# EAGLE design BPMLabLineRX3.2 (EAGLE 7.5.0)
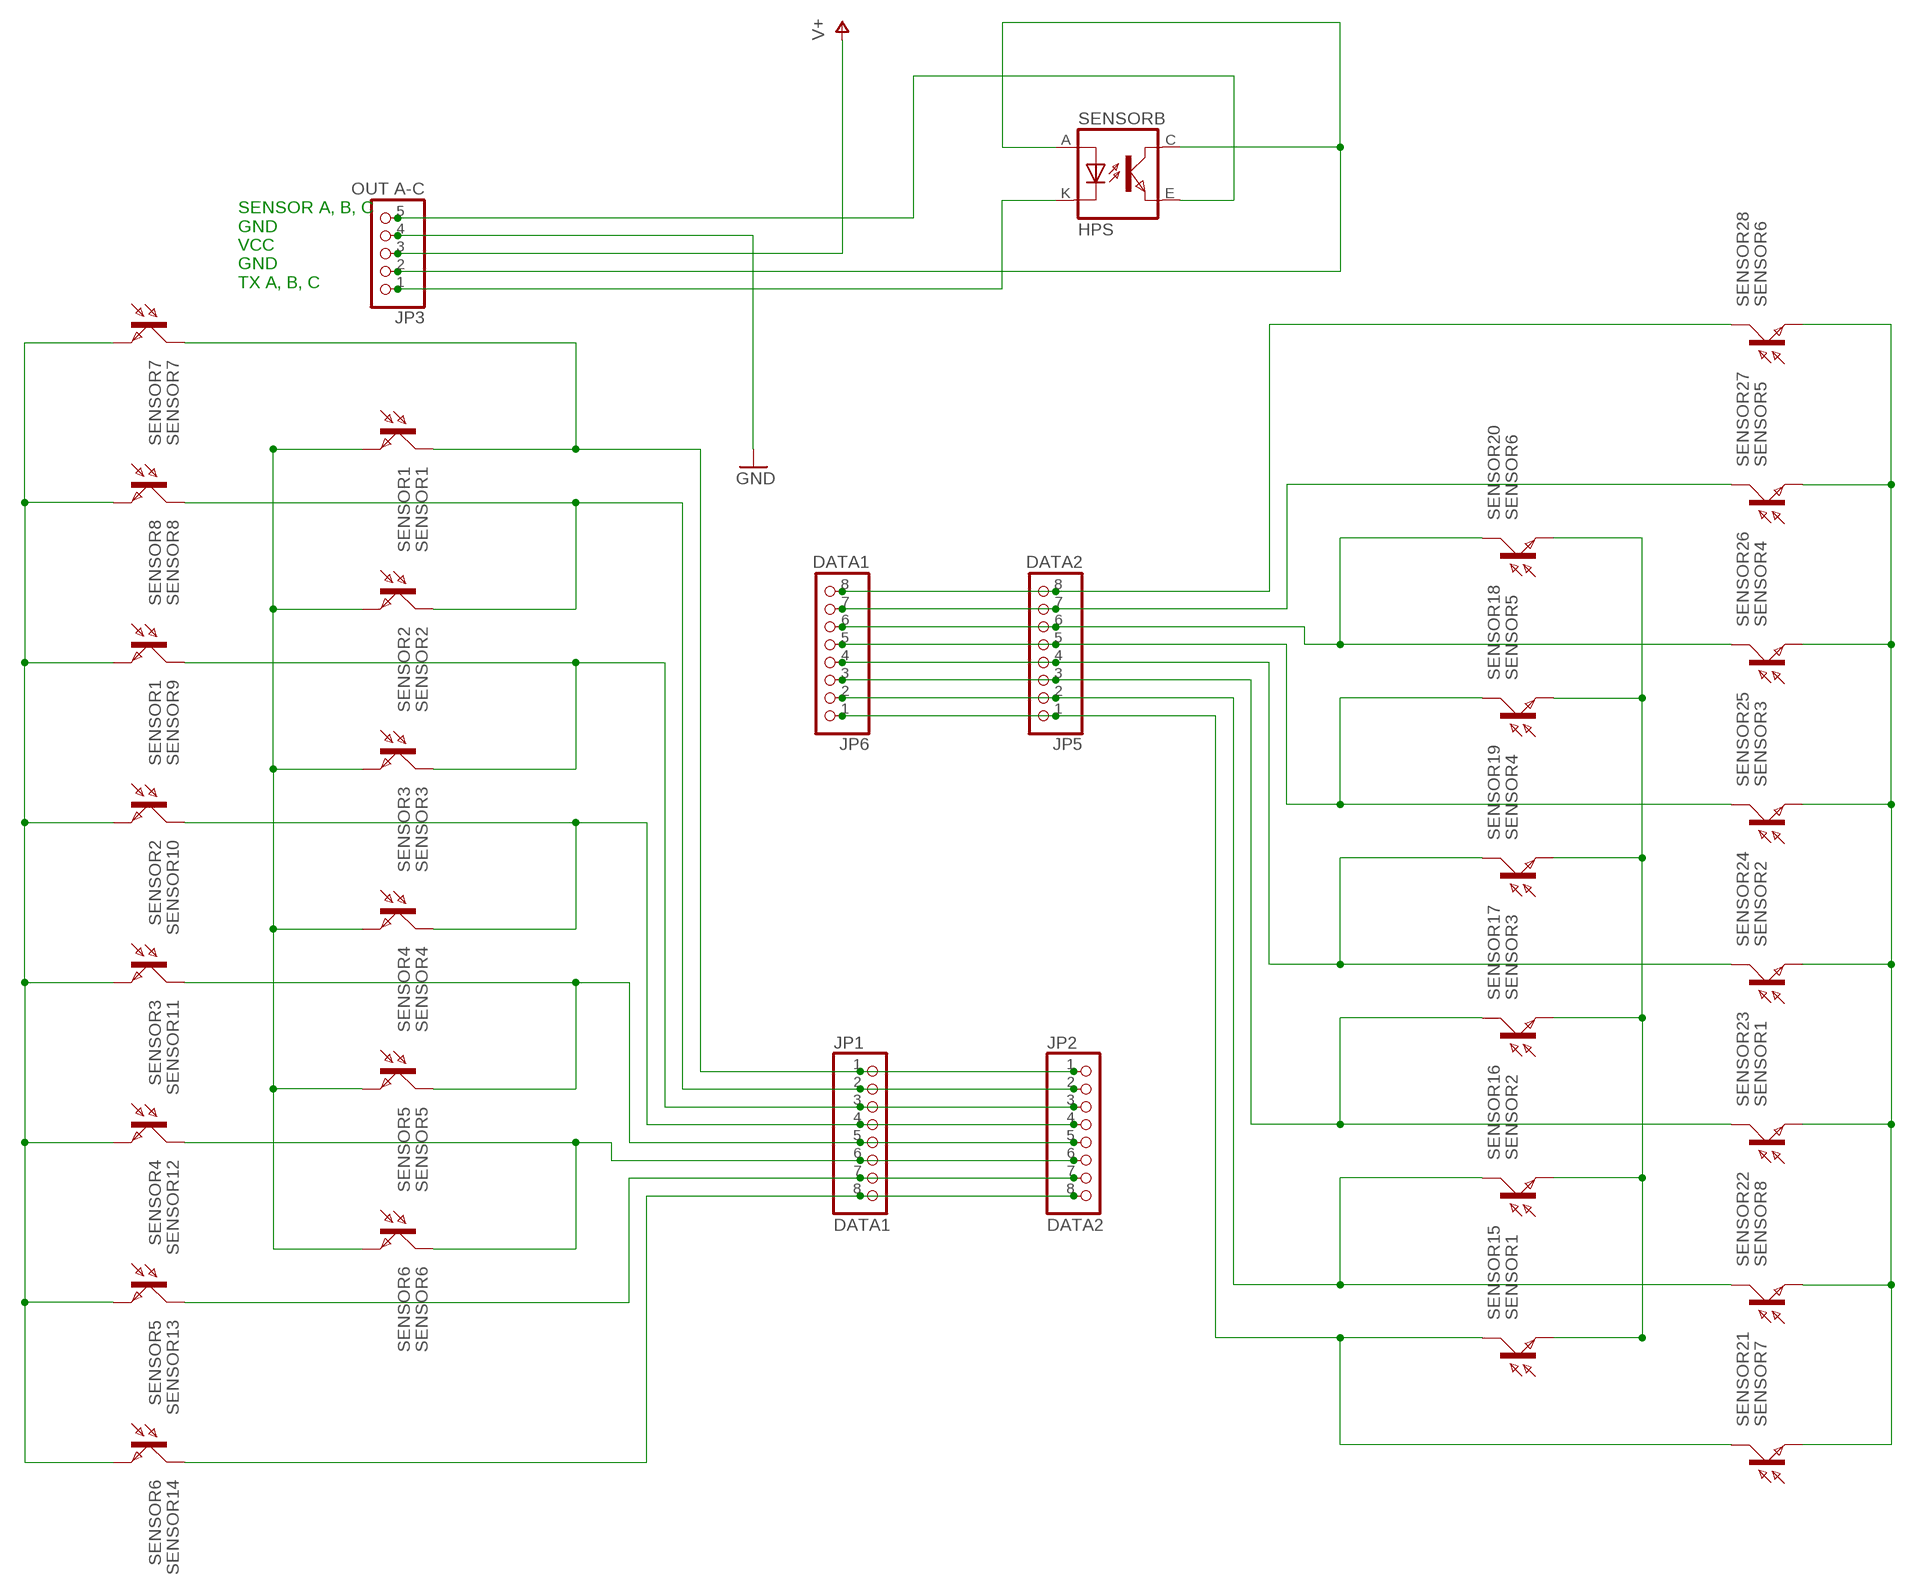
[diagram p0: schematic, sheet 1]

## Parts
JP1  DATA1  PINHD-1X8  [1X08]
JP2  DATA2  PINHD-1X8  [1X08]
JP3  OUT A-C  PINHD-1X5  [1X05]
JP5  DATA2  PINHD-1X8  [1X08]
JP6  DATA1  PINHD-1X8  [1X08]
SENSOR1  SENSOR1  BPX81  [BPX81]
SENSOR2  SENSOR2  BPX81  [BPX81]
SENSOR3  SENSOR3  BPX81  [BPX81]
SENSOR4  SENSOR4  BPX81  [BPX81]
SENSOR5  SENSOR5  BPX81  [BPX81]
SENSOR6  SENSOR6  BPX81  [BPX81]
SENSOR7  SENSOR7  BPX81  [BPX81]
SENSOR8  SENSOR8  BPX81  [BPX81]
SENSOR9  SENSOR1  BPX81  [BPX81]
SENSOR10  SENSOR2  BPX81  [BPX81]
SENSOR11  SENSOR3  BPX81  [BPX81]
SENSOR12  SENSOR4  BPX81  [BPX81]
SENSOR13  SENSOR5  BPX81  [BPX81]
SENSOR14  SENSOR6  BPX81  [BPX81]
SENSOR15  SENSOR1  BPX81  [BPX81]
SENSOR16  SENSOR2  BPX81  [BPX81]
SENSOR17  SENSOR3  BPX81  [BPX81]
SENSOR18  SENSOR5  BPX81  [BPX81]
SENSOR19  SENSOR4  BPX81  [BPX81]
SENSOR20  SENSOR6  BPX81  [BPX81]
SENSOR21  SENSOR7  BPX81  [BPX81]
SENSOR22  SENSOR8  BPX81  [BPX81]
SENSOR23  SENSOR1  BPX81  [BPX81]
SENSOR24  SENSOR2  BPX81  [BPX81]
SENSOR25  SENSOR3  BPX81  [BPX81]
SENSOR26  SENSOR4  BPX81  [BPX81]
SENSOR27  SENSOR5  BPX81  [BPX81]
SENSOR28  SENSOR6  BPX81  [BPX81]
SENSORB  HPS  TCRT5000  [TCRT5000]

## Nets
GND: JP3.4
N$1: JP5.1 JP6.1 SENSOR15.C SENSOR21.C
N$2: JP5.2 JP6.2 SENSOR16.C SENSOR22.C
N$3: JP1.1 JP2.1 SENSOR1.C SENSOR7.C
N$4: JP1.2 JP2.2 SENSOR2.C SENSOR8.C
N$5: SENSOR15.E SENSOR16.E SENSOR17.E SENSOR18.E SENSOR19.E SENSOR20.E
N$6: SENSOR21.E SENSOR22.E SENSOR23.E SENSOR24.E SENSOR25.E SENSOR26.E SENSOR27.E SENSOR28.E
N$7: JP5.3 JP6.3 SENSOR17.C SENSOR23.C
N$8: JP5.4 JP6.4 SENSOR19.C SENSOR24.C
N$9: JP3.5 SENSORB.E(EMITTER)
N$10: JP3.1 SENSORB.K(CATHODE)
N$11: SENSOR1.E SENSOR2.E SENSOR3.E SENSOR4.E SENSOR5.E SENSOR6.E
N$12: SENSOR7.E SENSOR8.E SENSOR9.E SENSOR10.E SENSOR11.E SENSOR12.E SENSOR13.E SENSOR14.E
N$13: JP1.3 JP2.3 SENSOR3.C SENSOR9.C
N$14: JP1.4 JP2.4 SENSOR4.C SENSOR10.C
N$15: JP1.5 JP2.5 SENSOR5.C SENSOR11.C
N$16: JP3.2 SENSORB.A(ANODE) SENSORB.C(COLLECTOR)
N$17: JP1.6 JP2.6 SENSOR6.C SENSOR12.C
N$18: JP5.5 JP6.5 SENSOR18.C SENSOR25.C
N$19: JP1.7 JP2.7 SENSOR13.C
N$20: JP1.8 JP2.8 SENSOR14.C
N$21: JP5.6 JP6.6 SENSOR20.C SENSOR26.C
N$22: JP5.7 JP6.7 SENSOR27.C
N$23: JP5.8 JP6.8 SENSOR28.C
V+: JP3.3

## Notes on the sheet
- SENSOR A, B, C
  GND
  VCC
  GND
  TX A, B, C

## Library data of the parts
JP1 JP2 JP5 JP6 = pinhead:PINHD-1X8: PIN HEADER
JP3 = pinhead:PINHD-1X5: PIN HEADER
SENSOR1-SENSOR28 = opto-trans-siemens:BPX81: PHOTO TRANSISTOR; OC_FARNELL: unknown; OC_NEWARK: unknown
SENSORB = tcrt5000:TCRT5000

## Board
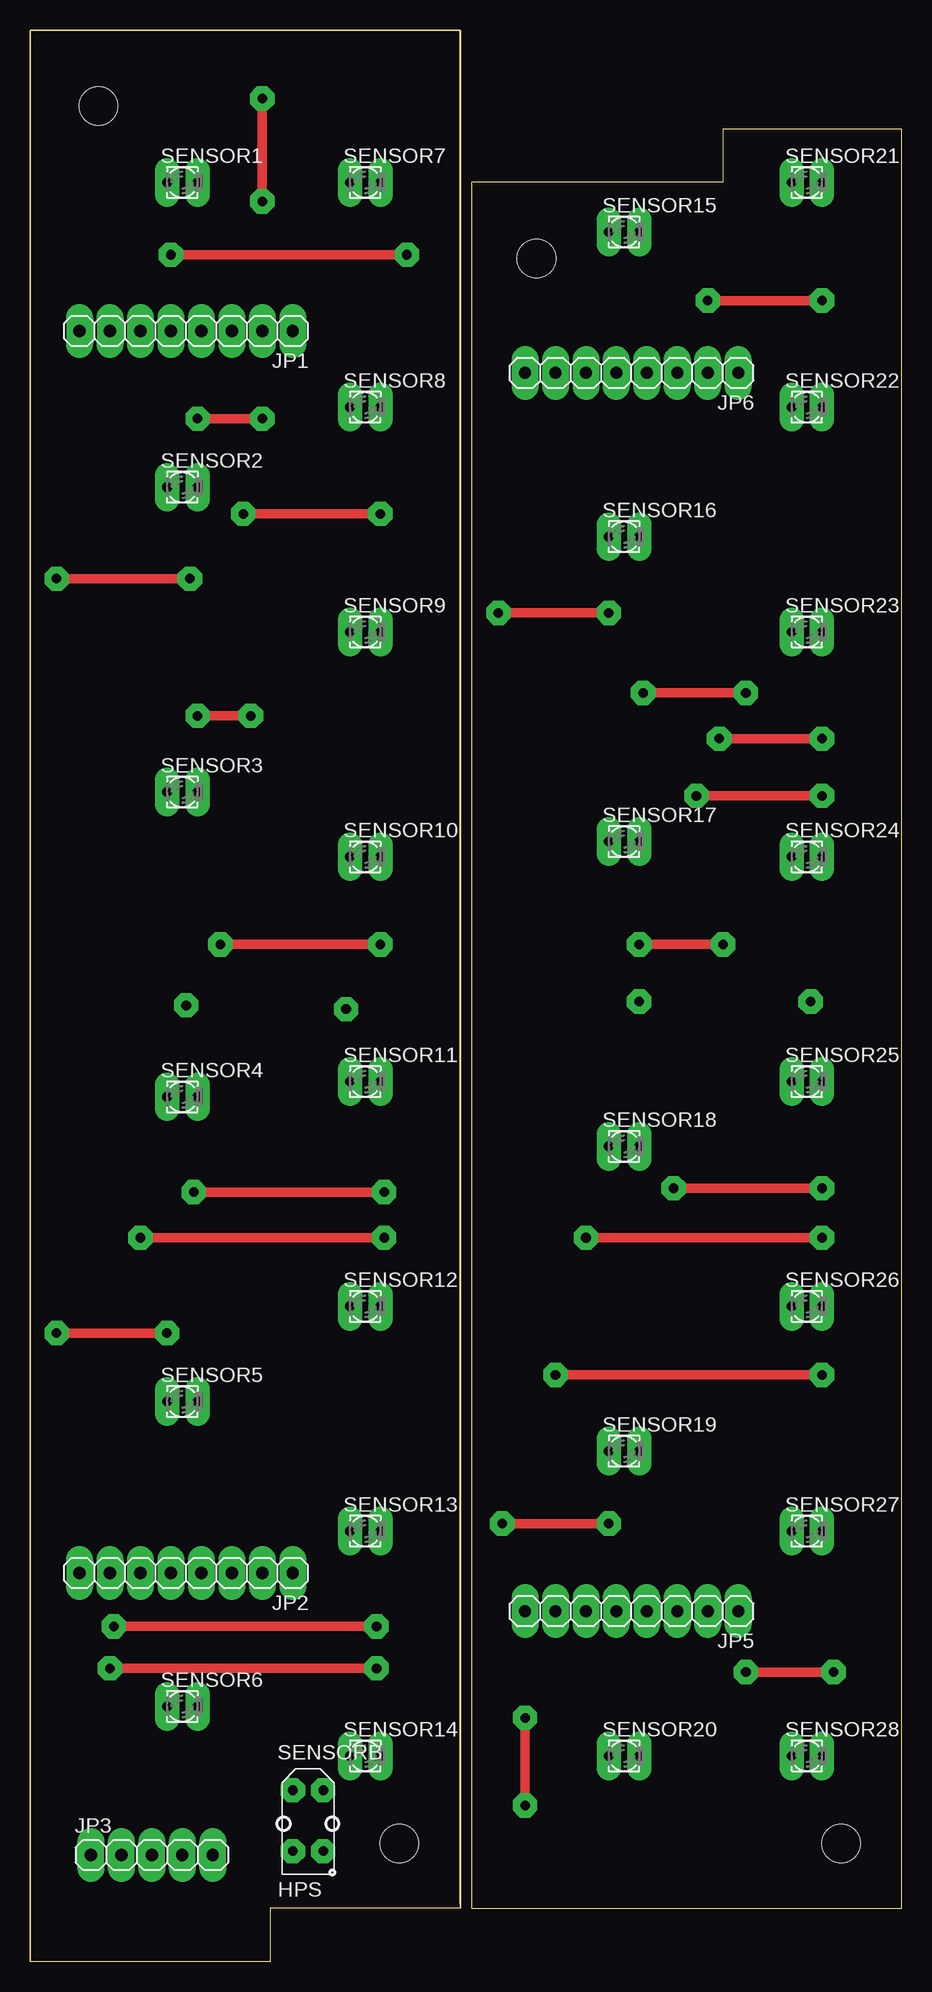
[diagram p1: board, top side]
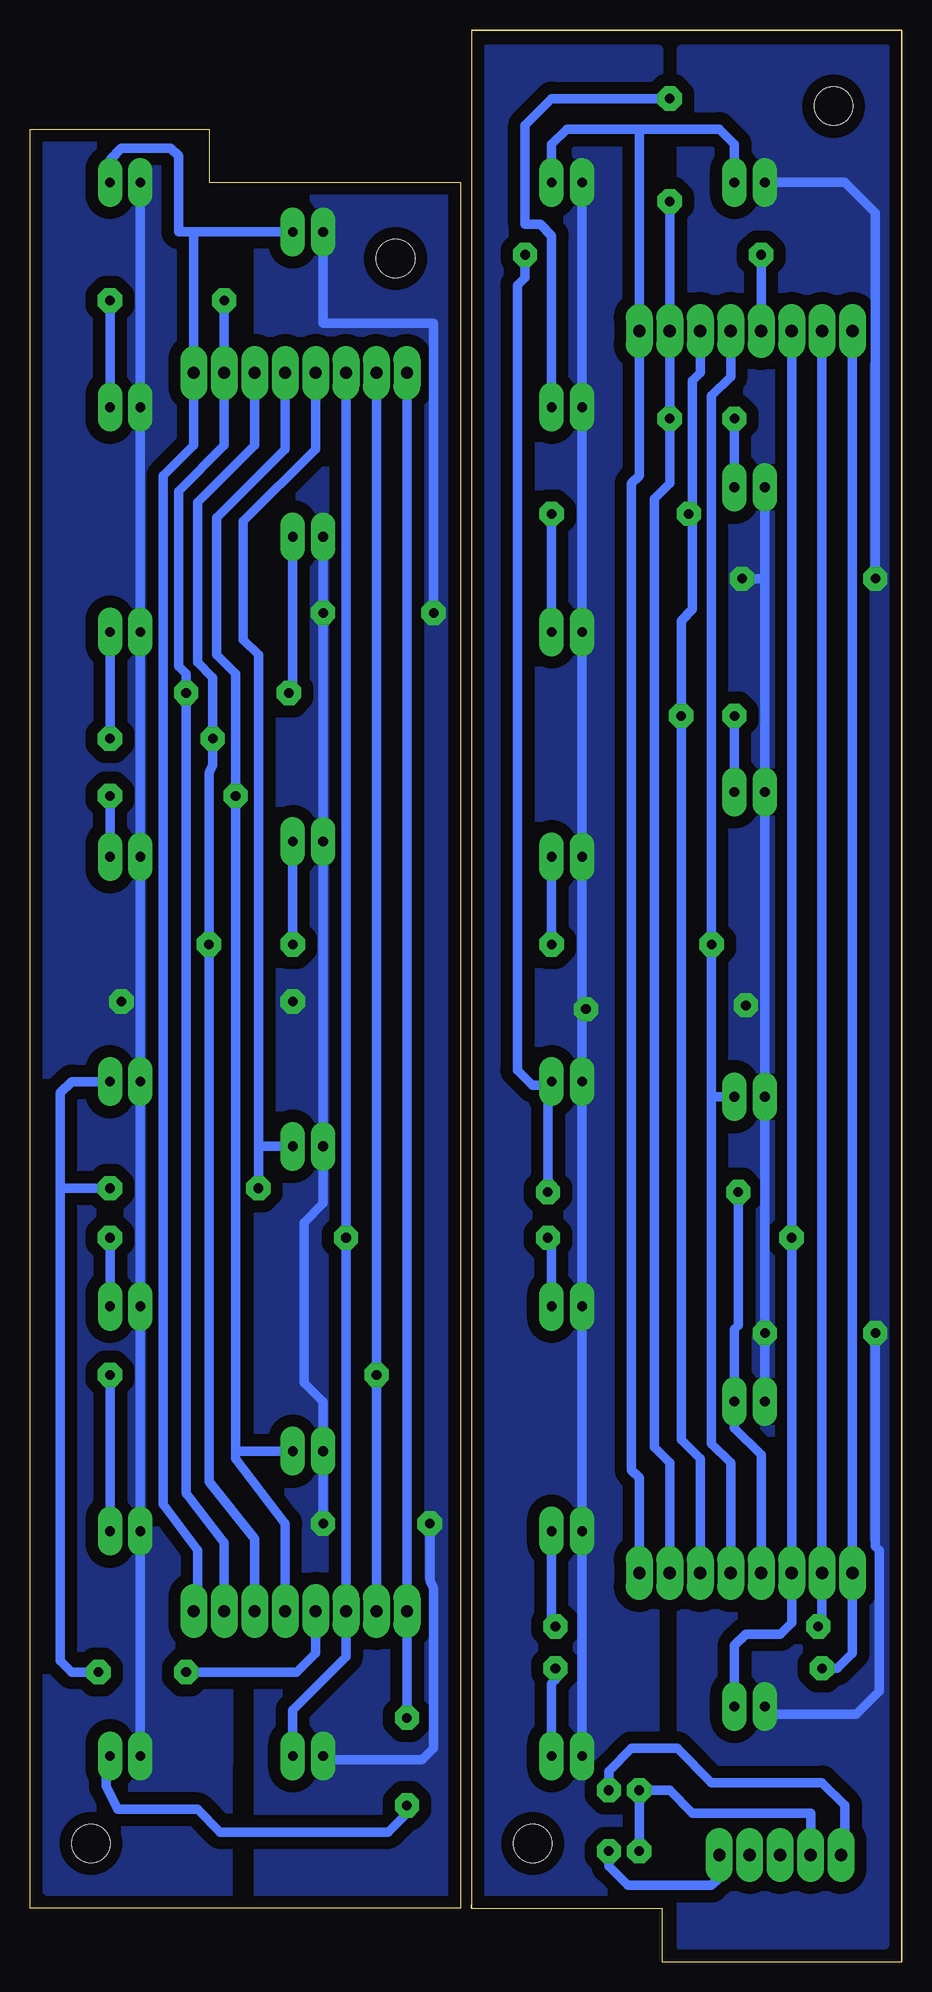
[diagram p2: board, bottom side, seen from below]

Size 72.71 x 160.97 mm. Coordinates in mm from the lower left corner, seen from the top.
Outline: 0,160.97 0,0 20,0 20,4.45 35.88,4.45 35.87,5.1 35.87,160.97 0,160.97
Outline: 36.83,148.27 36.83,4.46 72.69,4.46 72.71,152.72 57.78,152.72 57.78,148.27 36.83,148.27
Copper layers (1*16): Top 0.035mm / dielectric 1.5mm / Bottom 0.035mm
Design rules "botpcb *": minimum track width 0.8mm, minimum drill 0.8mm, track to track 0.3mm, track to pad 0.3mm, pad to pad 0.3mm, via to via 0.3mm, smd to smd 8mil, copper to edge 40mil, drill to drill 8mil, minimum pad ring 24mil, minimum via ring 24mil, stop-mask expansion 0mil, vias tented up to drill 0mil, thermal gap 0mil
Holes 3.2 mm at 5.71,154.62 42.23,141.92 30.8,9.84 67.63,9.84
Milling: 12 lines

### Footprints (pad centres in the part's own frame; a part is rotated, then mirrored left to right if it is on the bottom)
1X08 = drill 1.016 long: 1 -8.89,0; 2 -6.35,0; 3 -3.81,0; 4 -1.27,0; 5 1.27,0; 6 3.81,0; 7 6.35,0; 8 8.89,0
1X05 = drill 1.016 long: 1 -5.08,0; 2 -2.54,0; 3 0,0; 4 2.54,0; 5 5.08,0
BPX81 = drill 0.813 long: C 1.27,0; E -1.27,0
TCRT5000 = drill 0.8 octagon: A -2.54,-1.27; C 2.54,-1.27; E 2.54,1.27; K -2.54,1.27

### Placement (x,y rotation side)
JP1  13.02,135.89 180 top
JP2  13.02,32.38 180 top
JP3  10.16,8.89 0 top
JP5  50.16,29.21 180 top
JP6  50.16,132.4 180 top
SENSOR1  12.7,148.27 0 top
SENSOR2  12.7,122.87 0 top
SENSOR3  12.7,97.47 0 top
SENSOR4  12.7,72.07 0 top
SENSOR5  12.7,46.67 0 top
SENSOR6  12.7,21.27 0 top
SENSOR7  27.94,148.27 0 top
SENSOR8  27.94,129.54 0 top
SENSOR9  27.94,110.81 0 top
SENSOR10  27.94,92.08 0 top
SENSOR11  27.94,73.34 0 top
SENSOR12  27.94,54.61 0 top
SENSOR13  27.94,35.88 0 top
SENSOR14  27.94,17.14 0 top
SENSOR15  49.53,144.15 0 top
SENSOR16  49.53,118.75 0 top
SENSOR17  49.53,93.34 0 top
SENSOR18  49.53,67.94 0 top
SENSOR19  49.53,42.55 0 top
SENSOR20  49.53,17.14 0 top
SENSOR21  64.77,148.27 0 top
SENSOR22  64.77,129.54 0 top
SENSOR23  64.77,110.81 0 top
SENSOR24  64.77,92.08 0 top
SENSOR25  64.77,73.34 0 top
SENSOR26  64.77,54.61 0 top
SENSOR27  64.77,35.88 0 top
SENSOR28  64.77,17.14 0 top
SENSORB  23.18,11.75 270 top

### Tracks (layer width: path | path; a pad name or v marks a point on that pad's centre or on a via)
N$1
  Bottom 0.8: JP5.1 58.74,29.53 58.74,34.29 61.59,38.1 61.59,123.83 59.05,126.36 JP6.1 59.05,144.15 | SENSOR15.C 59.05,144.15 | 59.05,144.15 60.33,144.15 60.33,150.5 60.96,151.13 65.09,151.13 66.04,150.18 SENSOR21.C
N$2  (via drill 0.8)
  Top 0.8: v66.04,138.43 v56.52,138.43 | v51.12,105.73 v59.69,105.73
  Bottom 0.8: JP5.2 56.52,34.92 59.69,39.05 v59.69,105.73 59.69,107.31 60.33,107.95 60.33,122.56 56.52,126.36 JP6.2 v56.52,138.43 | SENSOR22.C v66.04,138.43 | SENSOR16.C 50.8,106.05 v51.12,105.73
N$3
  Bottom 0.8: SENSOR7.C 29.21,151.45 27.94,152.72 21.91,152.72 | 21.91,152.72 15.24,152.72 13.97,151.45 SENSOR1.C | 21.91,152.72 JP1.1 21.91,123.83 22.54,123.19 22.54,40.96 21.91,40.32 JP2.1
N$4  (via drill 0.8)
  Top 0.8: v19.37,155.26 v19.37,146.69 | v13.97,128.59 v19.37,128.59
  Bottom 0.8: JP2.2 19.37,41.59 20.64,42.86 20.64,121.92 19.37,123.19 v19.37,128.59 JP1.2 v19.37,146.69 | SENSOR8.C 29.21,143.83 30.16,144.78 31.43,144.78 31.43,153.03 29.21,155.26 v19.37,155.26 | SENSOR2.C v13.97,128.59
N$5  (via drill 0.8)
  Top 0.8: v48.26,36.51 v39.37,36.51 | v48.26,112.39 v39.05,112.39
  Bottom 0.8: v48.26,36.51 SENSOR19.E 48.26,46.67 49.85,48.26 49.85,61.59 48.26,63.18 SENSOR18.E SENSOR17.E v48.26,112.39 SENSOR16.E | v39.37,36.51 39.37,31.75 39.05,31.11 39.05,17.78 40.01,16.83 47.94,16.83 SENSOR20.E | v39.05,112.39 39.05,136.53 48.26,136.53 SENSOR15.E
  other vias: 50.8,80.01
  pour Bottom (isolate 1.016): 53.66,147.32 53.66,5.4 38.42,5.4 37.78,6.03 37.78,146.69 38.42,147.32
N$6  (via drill 0.8)
  Bottom 0.8: SENSOR21.E SENSOR22.E SENSOR23.E SENSOR24.E SENSOR25.E SENSOR26.E SENSOR27.E SENSOR28.E
  other vias: 65.09,80.01
  pour Bottom (isolate 1.016): 71.75,151.45 71.75,6.35 70.48,5.08 56.2,5.08 56.2,6.35 55.88,147.32 57.47,147.32 58.1,147.64 58.74,148.27 58.74,151.13 59.37,151.76 71.44,151.76
N$7  (via drill 0.8)
  Top 0.8: v66.04,101.92 v57.47,101.92 | v50.8,84.77 v57.78,84.77
  Bottom 0.8: JP5.3 53.98,35.24 57.78,40.01 v57.78,84.77 57.78,99.06 57.47,99.69 v57.47,101.92 57.47,107 58.74,108.27 58.74,121.6 53.98,126.36 JP6.3 | SENSOR23.C v66.04,101.92 | SENSOR17.C v50.8,84.77
N$8  (via drill 0.8)
  Top 0.8: v66.04,97.16 v55.56,97.16
  Bottom 0.8: JP5.4 51.44,36.51 55.56,41.91 55.56,42.55 | 55.56,42.55 v55.56,97.16 55.56,107.31 57.15,108.9 57.15,120.33 51.44,126.05 JP6.4 | SENSOR19.C 55.56,42.55 | SENSOR24.C v66.04,97.16
N$9
  Bottom 0.8: SENSORB.E 24.45,7.94 22.86,6.35 15.88,6.35 15.24,6.99 JP3.5
N$10
  Bottom 0.8: SENSORB.K 24.45,15.88 22.54,17.78 18.73,17.78 15.88,14.92 6.67,14.92 4.76,13.02 4.76,9.21 JP3.1
N$11  (via drill 0.8)
  Top 0.8: v2.22,115.25 v13.34,115.25 | v11.43,52.39 v2.22,52.39
  Bottom 0.8: SENSOR2.E 11.43,115.25 | 11.43,115.25 SENSOR3.E SENSOR4.E SENSOR5.E v11.43,52.39 | SENSOR1.E 4.76,148.27 2.22,145.73 v2.22,115.25 | v13.34,115.25 11.43,115.25 | v2.22,52.39 2.22,34.61 1.91,34.29 1.91,22.54 3.81,20.64 10.79,20.64 SENSOR6.E
  other vias: 13.02,79.69
  pour Bottom (isolate 1.016): 18.41,159.38 1.27,159.38 0.95,159.07 0.95,1.91 1.59,1.27 18.41,1.27
N$12  (via drill 0.8)
  Bottom 0.8: SENSOR7.E SENSOR8.E SENSOR9.E SENSOR10.E SENSOR11.E SENSOR12.E SENSOR13.E SENSOR14.E
  other vias: 26.35,79.38
  pour Bottom (isolate 1.016): 34.92,159.38 34.92,5.71 34.29,5.08 20.64,5.08 20.64,5.4 20.32,159.07 20.32,159.38
N$13  (via drill 0.8)
  Top 0.8: v13.97,103.82 v18.41,103.82 | v29.21,120.65 v17.78,120.65
  Bottom 0.8: JP2.3 16.83,41.91 18.41,43.5 v18.41,103.82 18.41,111.76 17.46,112.71 17.46,120.33 | 17.46,120.33 17.46,131.76 16.83,132.4 JP1.3 | SENSOR3.C v13.97,103.82 | SENSOR9.C v29.21,120.65 | v17.78,120.65 17.46,120.33
N$14  (via drill 0.8)
  Top 0.8: v29.21,84.77 v15.88,84.77
  Bottom 0.8: JP2.4 14.29,41.59 15.88,43.18 15.88,72.07 | SENSOR4.C 15.88,72.07 | 15.88,72.07 v15.88,84.77 15.88,130.49 14.29,132.08 JP1.4 | SENSOR10.C v29.21,84.77
N$15  (via drill 0.8)
  Top 0.8: v11.75,142.24 v31.43,142.24 | v29.53,64.14 v13.65,64.14
  Bottom 0.8: JP1.5 v11.75,142.24 | v31.43,142.24 31.43,140.34 32.07,139.7 32.07,74.3 30.8,73.03 29.53,73.03 | 29.53,73.03 SENSOR11.C | JP2.5 11.75,42.23 13.97,44.45 SENSOR5.C 13.97,52.7 13.65,53.02 v13.65,64.14 | 29.53,73.03 v29.53,64.14
N$16
  Bottom 0.8: SENSORB.C SENSORB.A 19.37,14.29 17.46,12.38 7.62,12.38 JP3.2
N$17  (via drill 0.8)
  Top 0.8: v29.53,60.33 v9.21,60.33
  Bottom 0.8: JP1.6 v9.21,60.33 JP2.6 9.21,28.26 10.16,27.3 13.02,27.3 13.97,26.35 SENSOR6.C | SENSOR12.C 29.21,60.01 v29.53,60.33
N$18  (via drill 0.8)
  Top 0.8: v59.69,24.13 v66.99,24.13 | v53.66,64.45 v66.04,64.45
  Bottom 0.8: JP5.5 48.9,25.72 50.48,24.13 v59.69,24.13 | v66.99,24.13 69.22,24.13 70.17,25.08 70.17,64.77 | 70.17,64.77 70.17,72.39 69.22,73.34 SENSOR25.C | JP6.5 48.9,126.05 54.93,120.02 54.93,110.17 53.66,108.9 53.66,67.94 | 53.66,67.94 SENSOR18.C | 53.66,67.94 v53.66,64.45 | v66.04,64.45 69.85,64.45 70.17,64.77
N$19  (via drill 0.8)
  Top 0.8: v6.99,27.94 v28.89,27.94
  Bottom 0.8: JP1.7 JP2.7 6.67,28.26 v6.99,27.94 | v28.89,27.94 29.21,28.26 SENSOR13.C
N$20  (via drill 0.8)
  Top 0.8: v6.67,24.45 v28.89,24.45
  Bottom 0.8: JP1.8 JP2.8 4.13,25.72 5.4,24.45 v6.67,24.45 | v28.89,24.45 28.89,23.5 29.21,23.18 SENSOR14.C
N$21  (via drill 0.8)
  Top 0.8: v46.35,60.33 v66.04,60.33
  Bottom 0.8: JP6.6 v46.35,60.33 JP5.6 46.35,25.4 50.8,20.95 SENSOR20.C | v66.04,60.33 SENSOR26.C
N$22  (via drill 0.8)
  Top 0.8: v43.81,48.9 v66.04,48.9
  Bottom 0.8: JP6.7 v43.81,48.9 JP5.7 | v66.04,48.9 SENSOR27.C
N$23  (via drill 0.8)
  Top 0.8: v41.27,20.32 v41.27,13.02
  Bottom 0.8: JP6.8 JP5.8 v41.27,20.32 | v41.27,13.02 41.27,12.38 42.86,10.79 56.83,10.79 58.74,12.7 65.41,12.7 66.36,14.61 66.36,16.83 SENSOR28.C